# Altium project Lab03.PrjPcb
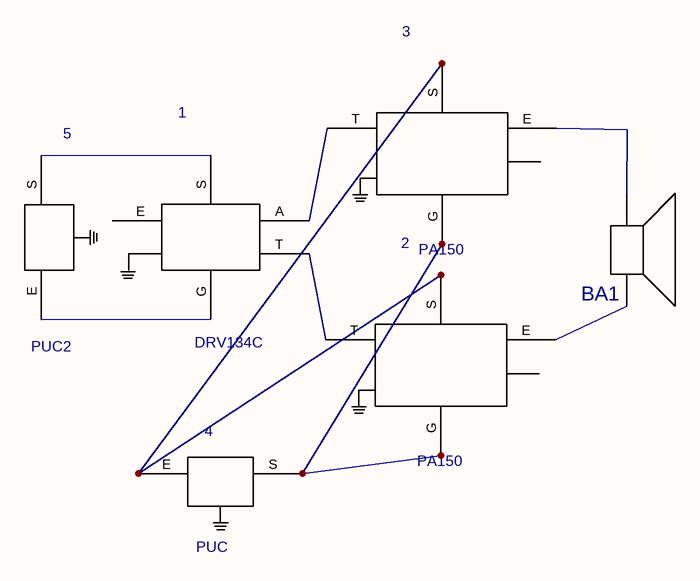
[diagram p0: Sheet1.SCHDOC]
1 sheet, 6 parts. Net scope: global (net labels, ports and power ports of the same name join across sheets).

## Sheet Sheet1.SCHDOC
size 297 x 209 mm; SheetNumber: 1; SheetTotal: 1; DocumentName: Sheet1.SCHDOC

### Parts
1  DRV134C  [DRV134P]
2  PA150  [PA150P]
3  PA150  [PA150P]
4  PUC  [PUP]
5  PUC2  [PUP2]
BA1  0,25ГД-10  [0,25ГД-10]  (value not drawn)

### Nets
Net1_A: 1.A 3.T
Net1_G: 1.G 5.E
Net1_S: 1.S 5.S
Net1_T: 1.T 2.T
Net2_E: 2.E BA1.1
Net2_G: 2.G 3.G 4.S
Net2_S: 2.S 3.S 4.E
Net3_E: 3.E BA1.2

Not connected (* = marked no-connect by the designer): 1 E; BA1 3 4 5 6

### Library data of the parts
1 = DRV134C: Value: *
2 3 = PA150: Value: *
4 = PUC: Value: *
5 = PUC2: Value: *
BA1 = 0,25ГД-10: Value: *